# Altium schematic sheet IB_VBE.SchDoc
size A4
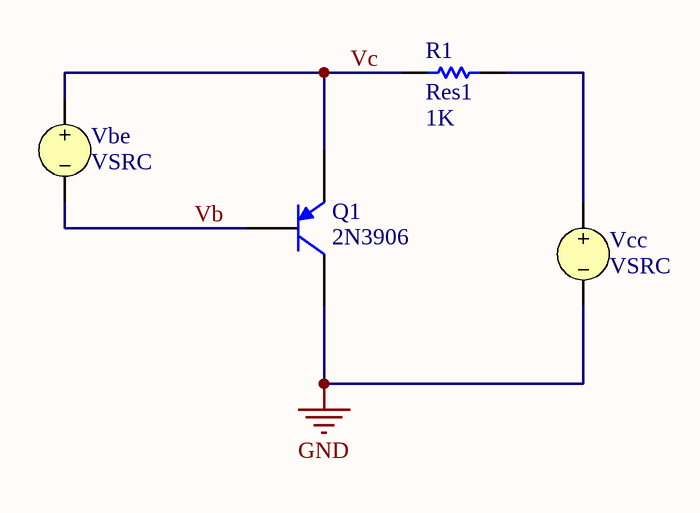
[diagram p0: IB_VBE.SchDoc]

## Parts
Q1  2N3906  [TO-92A]
R1  Res1  value 1K  [AXIAL-0.3]
Vbe  VSRC
Vcc  VSRC

## Nets
GND: Q1.3(C) Vcc.2
Vb: Q1.2(B) Vbe.2
Vc: Q1.1(E) R1.1 Vbe.1
NetR1_2: R1.2 Vcc.1

## Library data of the parts
Q1 = 2N3906: PNP General Purpose Amplifier; Published: 8-Jun-2000; LatestRevisionDate: 15-Jan-2003; LatestRevisionNote: PCB Footprint 'BCY-W3/D4.7' replaced; DatasheetDocument: 1997; PackageDocument: Sep-1998; PackageReference: TO-92A; Publisher: Altium Limited; Code_JEDEC: TO-92A; ComponentLink1Description: Manufacturer Link; ComponentLink1URL: http://www.fairchildsemi.com/; ComponentLink2Description: Datasheet; ComponentLink2URL: http://www.fairchildsemi.com/ds/2N%2F2N3906.pdf
R1 = Res1: Resistor; Published: 8-Jun-2000; LatestRevisionDate: 17-Jul-2002; LatestRevisionNote: Re-released for DXP Platform.; PackageReference: AXIAL-0.3; Publisher: Altium Limited
Vbe = VSRC: Voltage Source; Note: PCB Footprint - Not required; Value: 500m; Published: 8-Jun-2000; LatestRevisionDate: 17-Jul-2002; LatestRevisionNote: Re-released for DXP Platform.; PackageReference: Not Applicable; Publisher: Altium Limited
Vcc = VSRC: Voltage Source; Note: PCB Footprint - Not required; Value: 5; Published: 8-Jun-2000; LatestRevisionDate: 17-Jul-2002; LatestRevisionNote: Re-released for DXP Platform.; PackageReference: Not Applicable; Publisher: Altium Limited